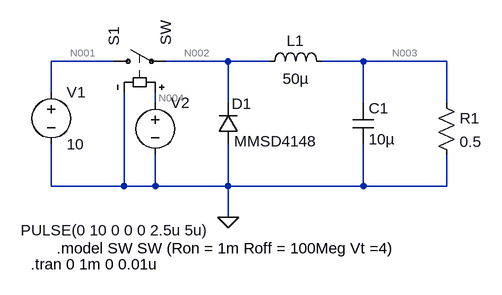
[diagram p0: schematic ReverseRecovery.asc]
ReverseRecovery.asc, the LTspice schematic file:
Version 4
SHEET 1 880 680
WIRE -32 96 -128 96
WIRE 144 96 48 96
WIRE 208 96 144 96
WIRE 352 96 288 96
WIRE 480 96 352 96
WIRE -128 144 -128 96
WIRE 32 160 32 144
WIRE 144 160 144 96
WIRE 352 160 352 96
WIRE 480 160 480 96
WIRE -128 288 -128 224
WIRE -16 288 -16 144
WIRE -16 288 -128 288
WIRE 32 288 32 240
WIRE 32 288 -16 288
WIRE 144 288 144 224
WIRE 144 288 32 288
WIRE 352 288 352 224
WIRE 352 288 144 288
WIRE 480 288 480 240
WIRE 480 288 352 288
WIRE 144 336 144 288
FLAG 144 336 0
SYMBOL diode 160 224 R180
WINDOW 0 -20 63 Left 2
WINDOW 3 -121 5 Left 2
SYMATTR InstName D1
SYMATTR Value MMSD4148
SYMBOL ind 192 112 R270
WINDOW 0 32 56 VTop 2
WINDOW 3 5 56 VBottom 2
SYMATTR InstName L1
SYMATTR Value 50µ
SYMBOL cap 336 160 R0
SYMATTR InstName C1
SYMATTR Value 10µ
SYMBOL res 464 144 R0
SYMATTR InstName R1
SYMATTR Value 0.5
SYMBOL sw -48 96 R270
SYMATTR InstName S1
SYMBOL voltage -128 128 R0
WINDOW 123 0 0 Left 0
WINDOW 39 0 0 Left 0
SYMATTR InstName V1
SYMATTR Value 10
SYMBOL voltage 32 144 R0
WINDOW 123 0 0 Left 0
WINDOW 39 0 0 Left 0
WINDOW 3 -207 212 Left 2
SYMATTR InstName V2
SYMATTR Value PULSE(0 10 0 0 0 2.5u 5u)
TEXT -120 384 Left 2 !.model SW SW (Ron = 1m Roff = 100Meg Vt =4)
TEXT -160 408 Left 2 !.tran 0 1m 0 0.01u

The netlist it stands for:
* ReverseRecovery.asc
D1 0 N002 MMSD4148
L1 N002 N003 50µ
C1 N003 0 10µ
R1 N003 0 0.5
S1 N001 N002 N004 0 SW
V1 N001 0 10
V2 N004 0 PULSE(0 10 0 0 0 2.5u 5u)
.model D D
.lib standard.dio
.model SW SW (Ron = 1m Roff = 100Meg Vt =4)
.tran 0 1m 0 0.01u
.backanno
.end

* Results of the author's LTspice run, read from the files saved beside the schematic
* Operating Point, zero values left out:
*   V(n002) = 50.11 nV
*   V(n003) = 50 nV
*   V(n001) = 10 V
*   I(L1) = 100 nA
*   I(R1) = 100 nA
*   I(S1) = -100 nA
*   I(V1) = -100 nA
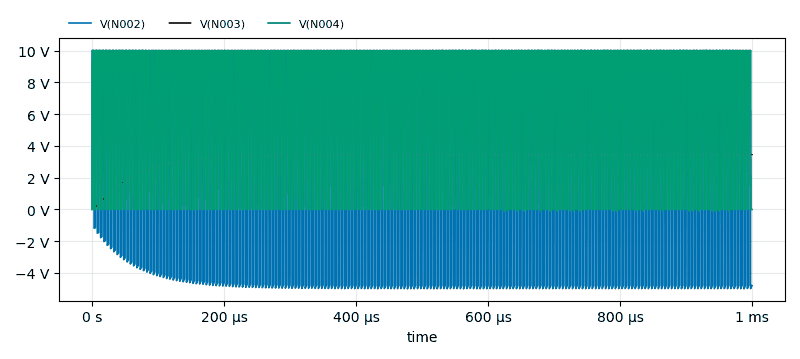
[diagram p1: Transient Analysis of ReverseRecovery.asc, plotted from the saved traces]
* Transient Analysis, 1 run:
*   V(N002): min -4.999 V, max 10.01 V, average 3.552 V, rms 8.1 V, last -4.794 V
*   V(N003): min 0 V, max 3.45 V, average 3.209 V, rms 3.265 V, last 3.44 V
*   V(N004): min -99.58 mV, max 10 V, average 5.5 V, rms 7.318 V, last 0 V